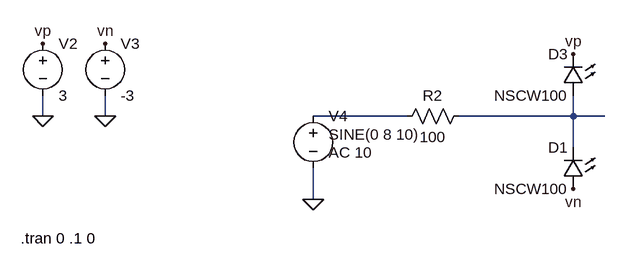
[diagram p0: schematic diode-limiter.asc]
diode-limiter.asc, the LTspice schematic file:
Version 4
SHEET 1 880 680
WIRE -352 -176 -352 -208
WIRE -256 -176 -256 -208
WIRE 208 -176 64 -176
WIRE 464 -176 464 -208
WIRE 464 -176 288 -176
WIRE 512 -176 464 -176
WIRE 464 -128 464 -176
WIRE 64 -48 64 -96
FLAG -352 -176 0
FLAG -256 -176 0
FLAG -352 -288 vp
FLAG -256 -288 vn
FLAG 64 -48 0
FLAG 464 -64 vn
FLAG 464 -272 vp
SYMBOL voltage -352 -304 R0
WINDOW 123 0 0 Left 0
WINDOW 39 0 0 Left 0
SYMATTR InstName V2
SYMATTR Value 3
SYMBOL voltage -256 -304 R0
WINDOW 123 0 0 Left 0
WINDOW 39 0 0 Left 0
SYMATTR InstName V3
SYMATTR Value -3
SYMBOL voltage 64 -192 R0
WINDOW 3 24 44 Left 2
WINDOW 123 24 72 Left 2
WINDOW 39 0 0 Left 0
SYMATTR InstName V4
SYMATTR Value SINE(0 8 10)
SYMATTR Value2 AC 10
SYMBOL res 304 -192 R90
WINDOW 0 0 56 VBottom 2
WINDOW 3 32 56 VTop 2
SYMATTR InstName R2
SYMATTR Value 100
SYMBOL LED 480 -208 R180
WINDOW 0 24 64 Left 2
WINDOW 3 24 0 Left 2
SYMATTR InstName D3
SYMATTR Value NSCW100
SYMATTR Description Diode
SYMATTR Type diode
SYMBOL LED 480 -64 R180
WINDOW 0 24 64 Left 2
WINDOW 3 24 0 Left 2
SYMATTR InstName D1
SYMATTR Value NSCW100
SYMATTR Description Diode
SYMATTR Type diode
TEXT -386 12 Left 2 !.tran 0 .1 0

The netlist it stands for:
* diode-limiter.asc
V2 vp 0 3
V3 vn 0 -3
V4 N001 0 SINE(0 8 10) AC 10
R2 N002 N001 100
D3 N002 vp NSCW100
D1 vn N002 NSCW100
.model D D
.lib standard.dio
.tran 0 .1 0
.backanno
.end